# EAGLE design RFID_USB_Reader-v14 (EAGLE 5.06)
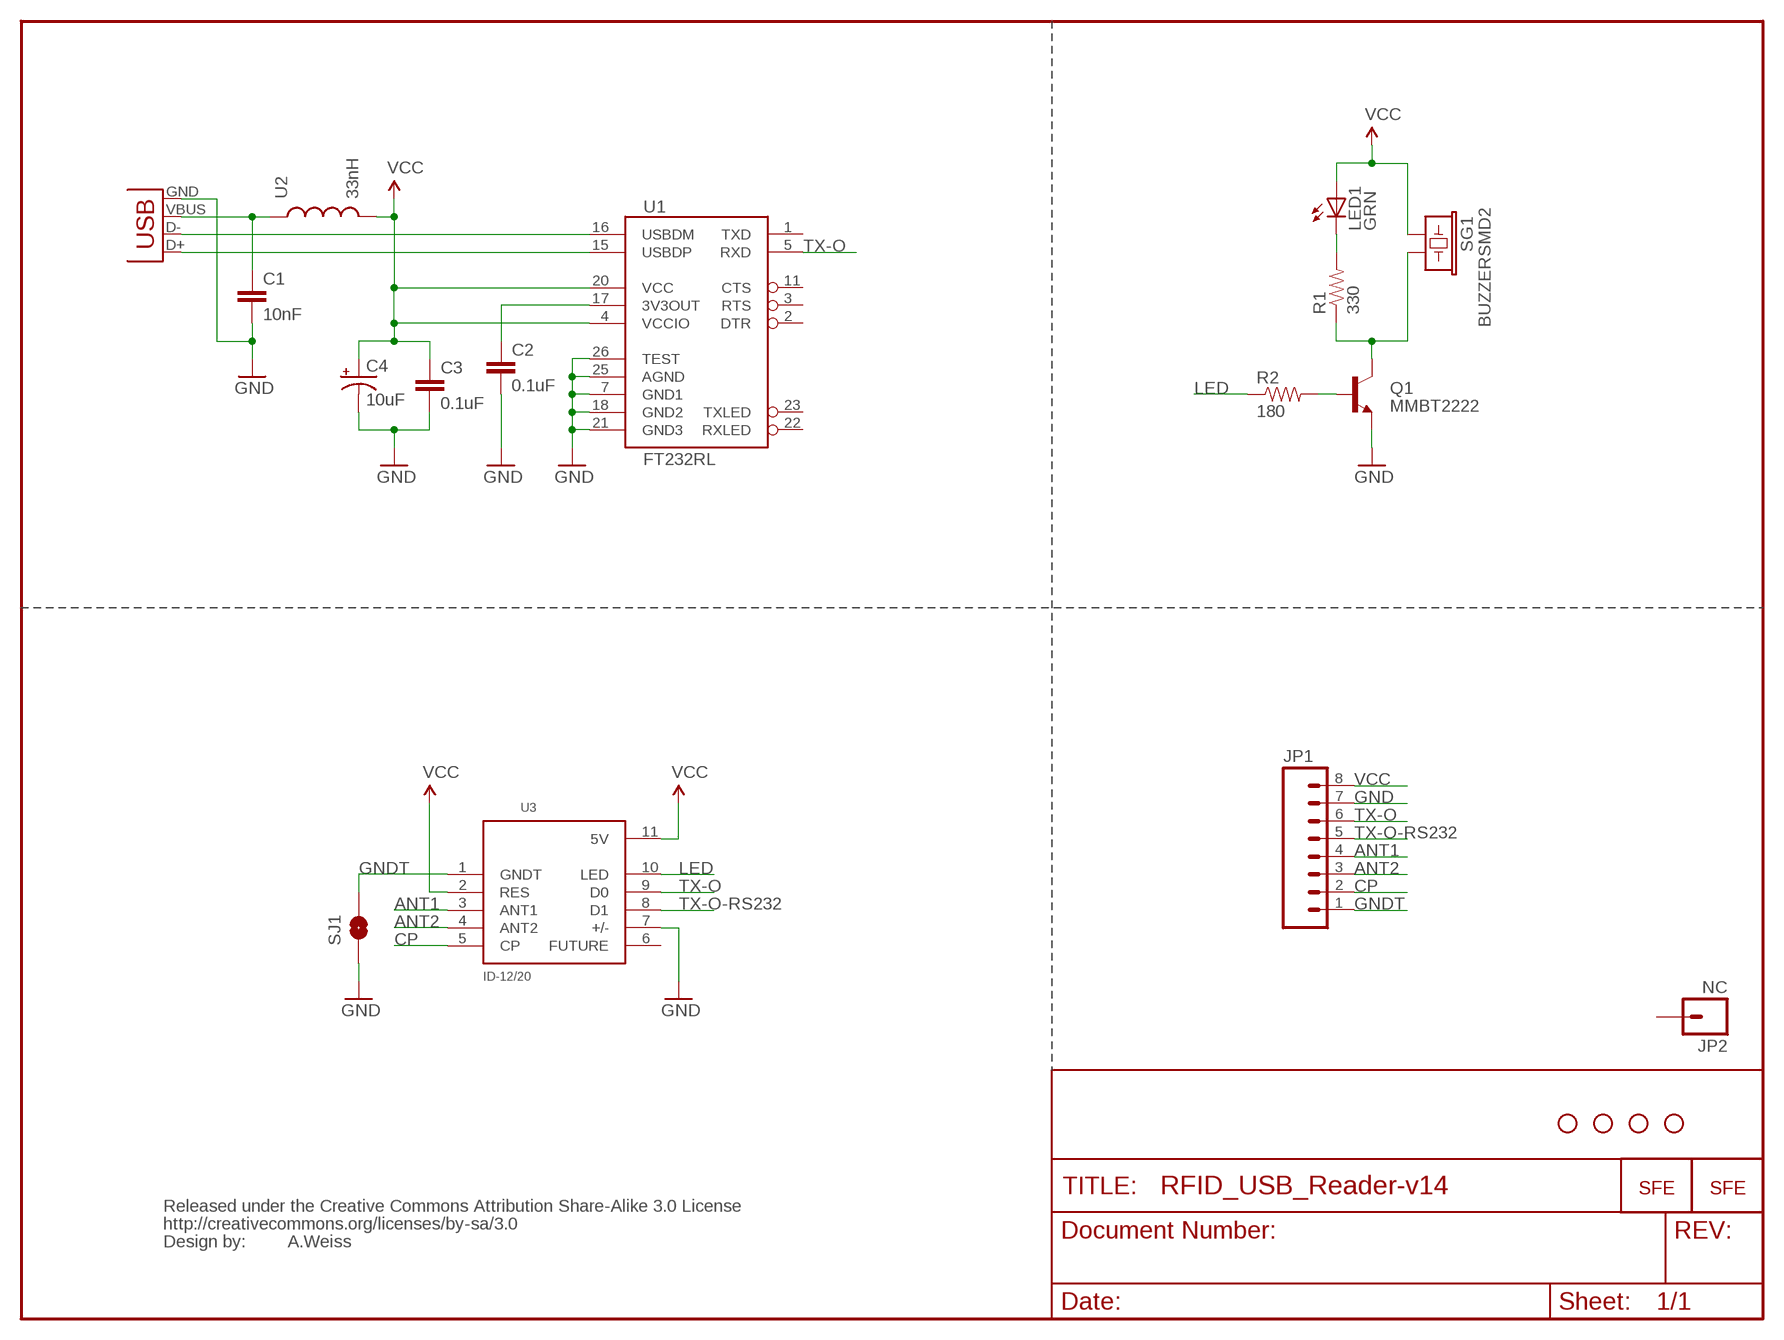
[diagram p0: schematic, sheet 1]

## Parts
C1  10nF  CAP0402  [C0402]
C2  0.1uF  CAP0402  [C0402]
C3  0.1uF  CAP0402  [C0402]
C4  10uF  CAP_POL1206  [EIA3216]
JP1  M08  [1X08]
JP2  NC  M01SMDNS  [1X01NS]
LED1  GRN  LED0603  [LED-0603]
Q1  MMBT2222  TRANSISTOR_NPNSOT23-3  [SOT23-3]
R1  330  RESISTOR0402  [C0402]
R2  180  RESISTOR0402  [C0402]
SG1  BUZZERSMD2  [BUZZER-CCV]
SJ1  SOLDERJUMPERNC2  [SJ_2S]
U1  FT232RL  FT232RL-BASICSSOP  [SSOP28DB]
U2  33nH  INDUCTOR0402  [C0402]
U3  ID-12/20  [ID-12]
U$1  LOGO-SFENEW  [SFE-NEW-WEBLOGO]
U$2  CREATIVE_COMMONS  [CREATIVE_COMMONS]
U$4  STAND-OFF  [STAND-OFF]
U$5  STAND-OFF  [STAND-OFF]
U$6  STAND-OFF  [STAND-OFF]
U$7  STAND-OFF  [STAND-OFF]
U$8  LOGO-SFESK  [SFE-LOGO-FLAME]
X1  USBSMD  [USB-MINIB]

## Nets
ANT1: JP1.4 U3.3(ANT1)
ANT2: JP1.3 U3.4(ANT2)
CP: JP1.2 U3.5(CP)
GND: C1.2 C2.2 C3.2 C4.C(-) JP1.7 Q1.2(E) SJ1.1 U1.7(GND1) U1.18(GND2) U1.21(GND3) U1.25(AGND) U1.26(TEST) U3.7(+/-) X1.GND
GNDT: JP1.1 SJ1.2 U3.1(GNDT)
LED: R2.1 U3.10(LED)
N$1: Q1.3(C) R1.1 SG1.-
N$2: U1.16(USBDM) X1.D-
N$3: C1.1 U2.1 X1.VBUS
N$4: U1.15(USBDP) X1.D+
N$6: C2.1 U1.17(3V3OUT)
N$7: LED1.C R1.2
N$8: Q1.1(B) R2.2
TX-O: JP1.6 U1.5(RXD) U3.9(D0)
TX-O-RS232: JP1.5 U3.8(D1)
VCC: C3.1 C4.A(+) JP1.8 LED1.A SG1.+ U1.4(VCCIO) U1.20(VCC) U2.2 U3.2(RES) U3.11(5V)
Unconnected: JP2.1 U1.1(TXD) U1.2(DTR) U1.3(RTS) U1.11(CTS) U1.22(RXLED) U1.23(TXLED) U3.6(FUTURE)

## Notes on the sheet
- A.Weiss

## Library data of the parts
C1-C3 = SparkFun:CAP: Capacitor Standard 0603 ceramic capacitor, and 0.1" leaded capacitor.
C4 = SparkFun:CAP_POL: Capacitor Polarized These are standard SMD and PTH capacitors. Normally 10uF, 47uF, and 100uF in electrolytic and tantalum varieties. Always verify the external diameter of the through hole cap, it varies with capacity, voltage, and manufacturer. The EIA devices should be standard.
JP1 = SparkFun:M08: Header 8 Standard 8-pin 0.1" header. Use with straight break away headers (SKU : PRT-00116), right angle break away headers (PRT-00553), swiss pins (PRT-00743), machine pins (PRT-00117), and female headers (PRT-00115).
JP2 = SparkFun:M01: Header 1 Standard 1-pin 0.1" header. Use with straight break away headers (SKU : PRT-00116), right angle break away headers (PRT-00553), swiss pins (PRT-00743), machine pins (PRT-00117), and female headers (PRT-00115).
LED1 = SparkFun:LED: LEDs Standard schematic elements and footprints for 5mm, 3mm, 1206, and 0603 sized LEDs. 5mm - Spark Fun Electronics SKU : COM-00529 (and others)
Q1 = SparkFun:TRANSISTOR_NPN: Transistor NPN BJT configuration in SOT23 package. MMBT2222 is the common NPN we use. Double check BCE configuration again layout.
R1 R2 = SparkFun:RESISTOR: Resistor Basic schematic elements and footprints for 0603, 1206, and PTH 1/10th watt (small) resistors.
SG1 = SparkFun:BUZZER: Buzzer 12mm Spark Fun Electronics SKU : Comp-Buzzer
SJ1 = SparkFun:SOLDERJUMPER: Solder Jumper Standard SMD solder jumper. Used to automate production. Two varients : Normally Open and Normally Closed are the same, but have different paste layers. NC will have a large amount of paste and should jumper during reflow.
U1 = SparkFun:FT232RL-BASIC: USB UART This is the simplified version of the FT232RL unit. Only what you need, nothing you don't. Spark Fun Electronics SKU : COM-00650
U2 = SparkFun:INDUCTOR: Inductors Basic Inductor/Choke - 0603 and 1206. Footprints are not proven and vary greatly between part numbers.
U3 = SparkFun:ID-12/20: ID2, ID12, and ID20 Package
U$1 U$8 = SparkFun:LOGO-SFE: Spark Fun Electronics PCB Logo This is the standard Spark Fun Electronics PCB logo.
U$2 = SparkFun:CREATIVE_COMMONS
U$4-U$7 = SparkFun:STAND-OFF: Stand Off This is the mechanical footprint for a #4 phillips button head screw. Use the keepout ring to avoid running the screw head into surrounding components. SKU : PRT-00447
X1 = SparkFun:USB: USB Connectors USB-B-PTH is fully proven SKU : PRT-00139 USB-miniB is fully proven SKU : PRT-00587 USB-A-PCB is untested. USB-A-H is throughly reviewed, but untested. Spark Fun Electronics SKU : PRT-00437 USB-B-SMT is throughly reviewed, but untested. Needs silkscreen touching up. USB-A-S has not been used/tested USB-MB-H has not been used/tested

## Board
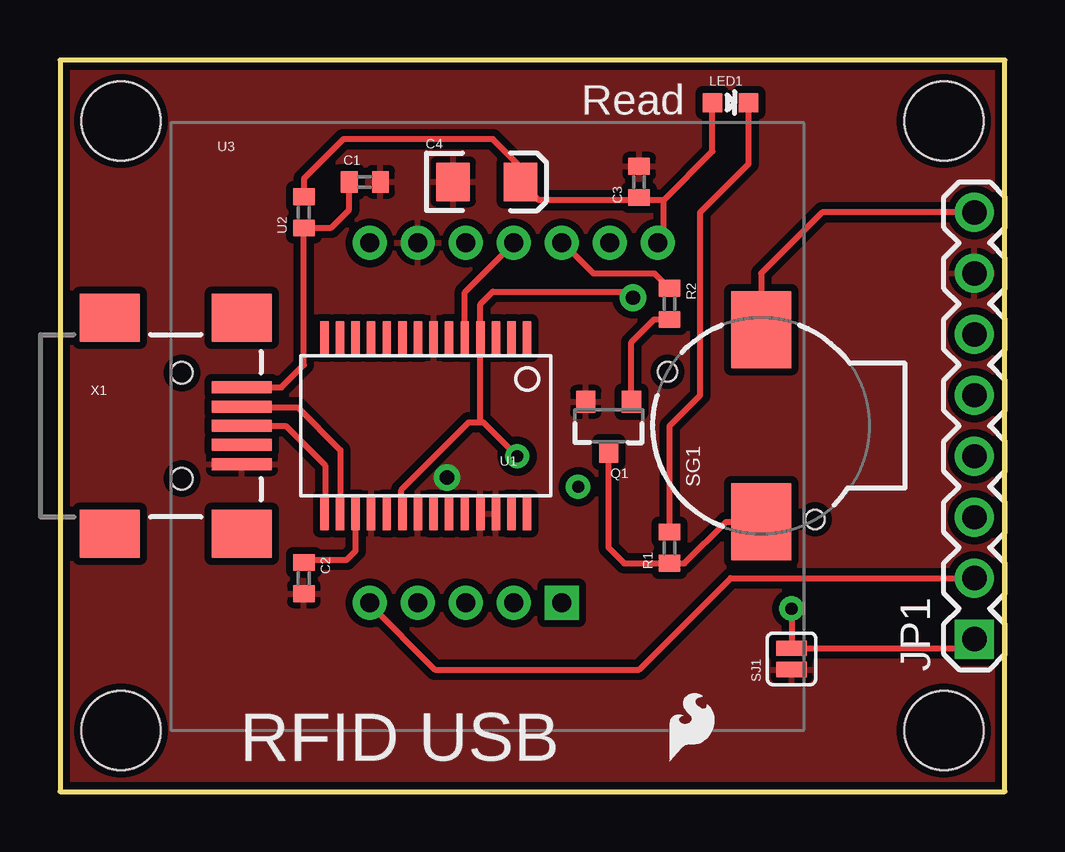
[diagram p1: board, top side]
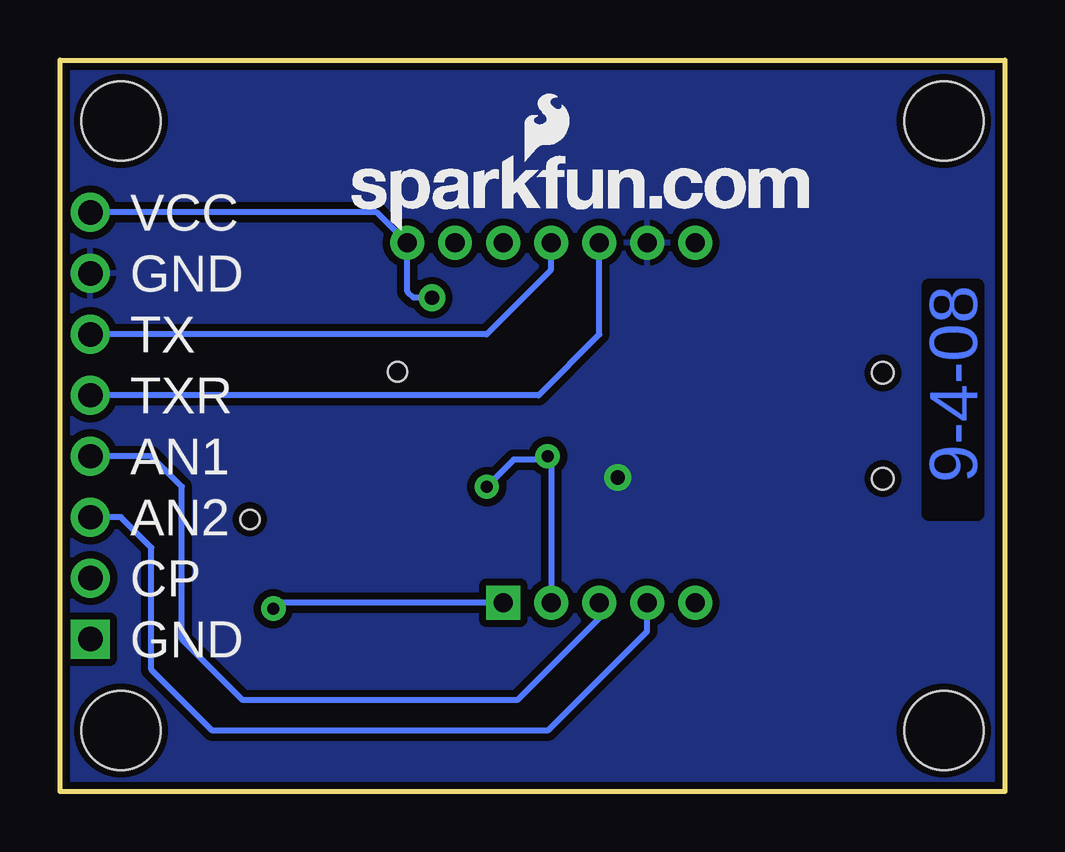
[diagram p2: board, bottom side, seen from below]

Size 39.37 x 30.48 mm. Coordinates in mm from the lower left corner, seen from the top.
Outline: 0,0 39.37,0 39.37,30.48 0,30.48 0,0
Copper layers (1*16): Top 0.035mm / dielectric 1.5mm / Bottom 0.035mm
Design rules "SparkFun": minimum track width 8mil, minimum drill 20mil, track to track 8mil, track to pad 8mil, pad to pad 8mil, via to via 8mil, smd to smd 8mil, copper to edge 10mil, drill to drill 8mil, minimum pad ring 12mil, minimum via ring 10mil, stop-mask expansion 4mil, vias tented up to drill 25mil, thermal gap 10mil

### Footprints (pad centres in the part's own frame; a part is rotated, then mirrored left to right if it is on the bottom)
C0402 = smd 0.7 x 0.9: 1 -0.65,0; 2 0.65,0
EIA3216 = smd 1.4 x 1.6: A 1.4,0; C -1.4,0
1X08 = drill 1.016 square: 1 0,0 | drill 1.016 round: 2 2.54,0; 3 5.08,0; 4 7.62,0; 5 10.16,0; 6 12.7,0; 7 15.24,0; 8 17.78,0
1X01NS = drill 0.8 round: 1 0,0
LED-0603 = smd 0.8 x 0.8: A 0,-0.75; C 0,0.75
SOT23-3 = smd 0.8 x 0.9: 1 -0.95,-1; 2 0.95,-1; 3 0,1.1
BUZZER-CCV = smd 3.2 x 2.5: + 4,0; - -4,0 | hole 0.8: -3.9,-2.25; 2.25,3.9
SJ_2S = smd 0.635 x 1.27: 1 0,0; 2 0.889,0
SSOP28DB = smd 0.348 x 1.397: 1 -4.225,-3.656; 2 -3.575,-3.656; 3 -2.925,-3.656; 4 -2.275,-3.656; 5 -1.625,-3.656; 6 -0.975,-3.656; 7 -0.325,-3.656; 8 0.325,-3.656; 9 0.975,-3.656; 10 1.625,-3.656; 11 2.275,-3.656; 12 2.925,-3.656; 13 3.575,-3.656; 14 4.225,-3.656; 15 4.225,3.656; 16 3.575,3.656; 17 2.925,3.656; 18 2.275,3.656; 19 1.625,3.656; 20 0.975,3.656; 21 0.325,3.656; 22 -0.325,3.656; 23 -0.975,3.656; 24 -1.625,3.656; 25 -2.275,3.656; 26 -2.925,3.656; 27 -3.575,3.656; 28 -4.225,3.656
ID-12 = drill 0.8 square: 1 16.255,5.32 | drill 0.8 round: 2 14.255,5.32; 3 12.255,5.32; 4 10.255,5.32; 5 8.255,5.32; 6 8.255,20.32; 7 10.255,20.32; 8 12.255,20.32; 9 14.255,20.32; 10 16.255,20.32; 11 20.255,20.32
STAND-OFF = hole 3.302: 0,0
USB-MINIB = smd 2.5 x 0.5: D+ 2.5,0; D- 2.5,0.8; GND 2.5,-1.6; ID 2.5,-0.8; VBUS 2.5,1.6 | smd 2.5 x 2: GND@1 -3,-4.5; GND@2 -3,4.5; GND@3 2.5,4.5; GND@4 2.5,-4.5 | hole 0.9: 0,2.2; 0,-2.2

### Placement (x,y rotation side)
C1  12.7,25.4 0 top
C2  10.16,8.89 270 top
C3  24.13,25.4 90 top
C4  17.78,25.4 0 top
JP1  38.1,6.35 90 top
JP2  22.91,22.86 0 top
LED1  27.94,28.7 270 top
Q1  22.86,15.24 180 top
R1  25.4,10.16 90 top
R2  25.4,20.32 270 top
SG1  29.21,15.24 90 top
SJ1  30.48,5.08 90 top
U1  15.24,15.24 180 top
U2  10.16,24.13 90 top
U3  4.65,2.54 0 top
U$1  27.23,23.37 0 bottom
U$2  20.32,-8.89 0 top  (outside the outline)
U$4  2.54,27.94 0 top
U$5  2.54,2.54 0 top
U$6  36.83,27.94 0 top
U$7  36.83,2.54 0 top
U$8  25.4,1.27 0 top
X1  5.08,15.24 0 top

### Tracks (layer width: path | path; a pad name or v marks a point on that pad's centre or on a via)
ANT1
  Bottom 0.254: U3.3 16.91,7.22 20.32,3.81 31.75,3.81 34.29,6.35 34.29,12.7 35.56,13.97 JP1.4
ANT2
  Bottom 0.254: U3.4 14.91,6.68 19.05,2.54 33.02,2.54 35.56,5.08 35.56,10.16 36.83,11.43 JP1.3
CP
  Top 0.254: JP1.2 27.94,8.89 24.13,5.08 15.62,5.08 12.91,7.79 U3.5
GND  (via drill 0.6)
  other vias: 16.13,13.08
  pour Top (isolate 0.305): 0,30.48 0,0 39.37,0 39.37,30.48
  pour Bottom (isolate 0.305): 0,30.48 0,0 39.37,0 39.37,30.48
GNDT  (via drill 0.51)
  Top 0.254: JP1.1 37.72,5.97 SJ1.2 v30.48,7.62
  Bottom 0.254: U3.1 30.24,7.86 v30.48,7.62
LED
  Top 0.254: 25.4,21.08 R2.1 25.4,20.95 24.77,21.59 22.23,21.59 20.95,22.86 U3.10
N$1
  Top 0.254: 22.73,13.97 22.86,14.1 Q1.3 22.86,10.16 23.51,9.51 R1.1 26.02,9.51 27.75,11.24 SG1.-
N$2
  Top 0.254: X1.D- 7.62,16 9.91,16 11.68,14.22 11.68,11.56 | 11.68,11.56 11.68,11.43 | 11.68,11.56 U1.16
N$3
  Top 0.254: X1.VBUS 9.22,16.84 10.16,17.78 U2.1 | U2.1 10.16,23.37 10.05,23.48 | C1.1 12.05,24.24 11.3,23.5 10.16,23.5 U2.1
N$4
  Top 0.254: X1.D+ 9.4,15.24 11.05,13.59 11.05,11.56 11.04,11.56 U1.15
N$6
  Top 0.254: U1.17 12.31,10.03 11.94,9.65 10.16,9.65 C2.1
N$7
  Top 0.254: 28.7,28.7 LED1.C 28.69,26.15 26.67,24.13 26.67,16.51 25.4,15.24 R1.2
N$8
  Top 0.254: 25.4,19.68 R2.2 24.75,19.67 23.81,18.73 Q1.1
TX-O
  Top 0.254: U1.5 16.86,20.8 18.91,22.84 U3.9
  Bottom 0.254: JP1.6 21.59,19.05 18.92,21.72 18.92,22.84 U3.9
TX-O-RS232
  Bottom 0.254: JP1.5 19.43,16.51 16.89,19.05 16.89,22.86 U3.8
VCC  (via drill 0.51, 0.6)
  Top 0.254: 24.13,24.64 C3.1 | 24.13,24.64 19.94,24.64 C4.A 19.05,25.4 19.05,26.16 18.03,27.18 11.81,27.18 10.16,25.53 U2.2 10.16,24.77 | 25.15,24.64 24.13,24.64 | U1.20 14.27,11.64 14.22,11.68 14.22,11.56 | 14.22,11.56 14.22,11.43 14.27,11.47 U1.20 | LED1.A 27.18,28.7 27.18,26.67 25.15,24.64 | 14.22,11.3 14.22,11.54 U1.20 | 17.52,15.38 U1.4 17.52,20.31 18.03,20.83 23.62,20.83 v23.88,20.57 | 17.52,15.38 17.03,15.38 14.22,12.57 14.22,11.56 | 14.22,11.56 14.25,11.58 U1.20 | U3.11 24.89,22.86 25.15,23.11 25.15,24.64 | 17.52,15.38 17.64,15.38 v19.05,13.97 | SG1.+ 29.21,21.59 31.75,24.13 JP1.8
  Bottom 0.254: 24.89,22.86 U3.11 | JP1.8 26.16,24.13 24.89,22.86 | 18.91,13.83 U3.2 | v19.05,13.97 18.91,13.83 | 18.91,13.83 20.46,13.83 v21.59,12.7 | 24.89,22.86 24.89,20.83 24.64,20.57 v23.88,20.57

### Text on the board
Bottom: 9-4-08
tPlace: Read | RFID USB
bPlace: VCC | GND | TX | TXR | AN1 | AN2 | CP | GND